# EAGLE design supply (EAGLE 4.11)
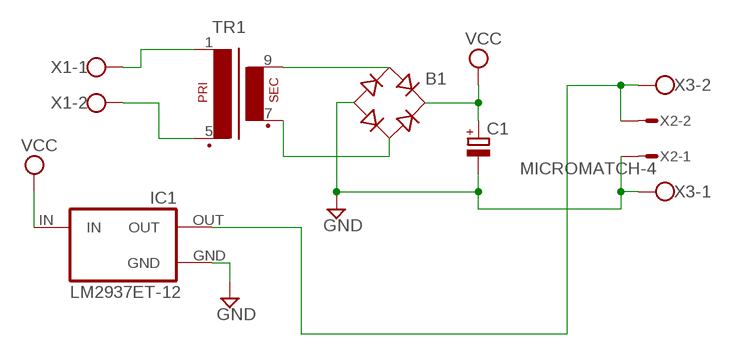
[diagram p0: schematic, sheet 1]

## Parts
B1  RB1A  [RB1A]
C1  CPOL-EUE5-10.5  [E5-10,5]
IC1  LM2937ET-12  [TO220(V)]
TR1  EI30-1  [EI30-1]
X1  W237-102  [W237-102]
X2  MICROMATCH-4  [MICROMATCH-4]
X3  W237-102  [W237-102]

## Nets
GND: B1.- C1.- IC1.GND X2.1 X3.1
N$1: TR1.1 X1.1
N$2: TR1.5 X1.2
N$3: B1.AC1 TR1.9
N$4: B1.AC2 TR1.7
N$7: IC1.OUT X2.2 X3.2
VCC: B1.+ C1.+ IC1.IN
Unconnected: X2.3 X2.4

## Library data of the parts
B1 = rectifier:RB1A: RECTIFIER 1 A
C1 = rcl:CPOL-EU: POLARIZED CAPACITOR, European symbol
IC1 = lm2937:LM2937ET*: 400 and 500 mA Low Dropout Voltage Regulator NATIONAL SEMICONDUCTOR created by Peter.Hofmann@ph-tronic.de <mailto:Reter.Hofmann@ph-tronic.de> 10-2004 Rev.0
TR1 = trafo:EI30-1: TRANSFORMER 1 primary winding, 1 secondary winding ERA
X1 X3 = con-wago-500:W237-102: WAGO SCREW CLAMP
X2 = con-amp-micromatch:MICROMATCH-4: MicroMaTch 4 7-215464-4 / 0-215464-4 Drawing Number C-215464 DDEController.pdf

## Board
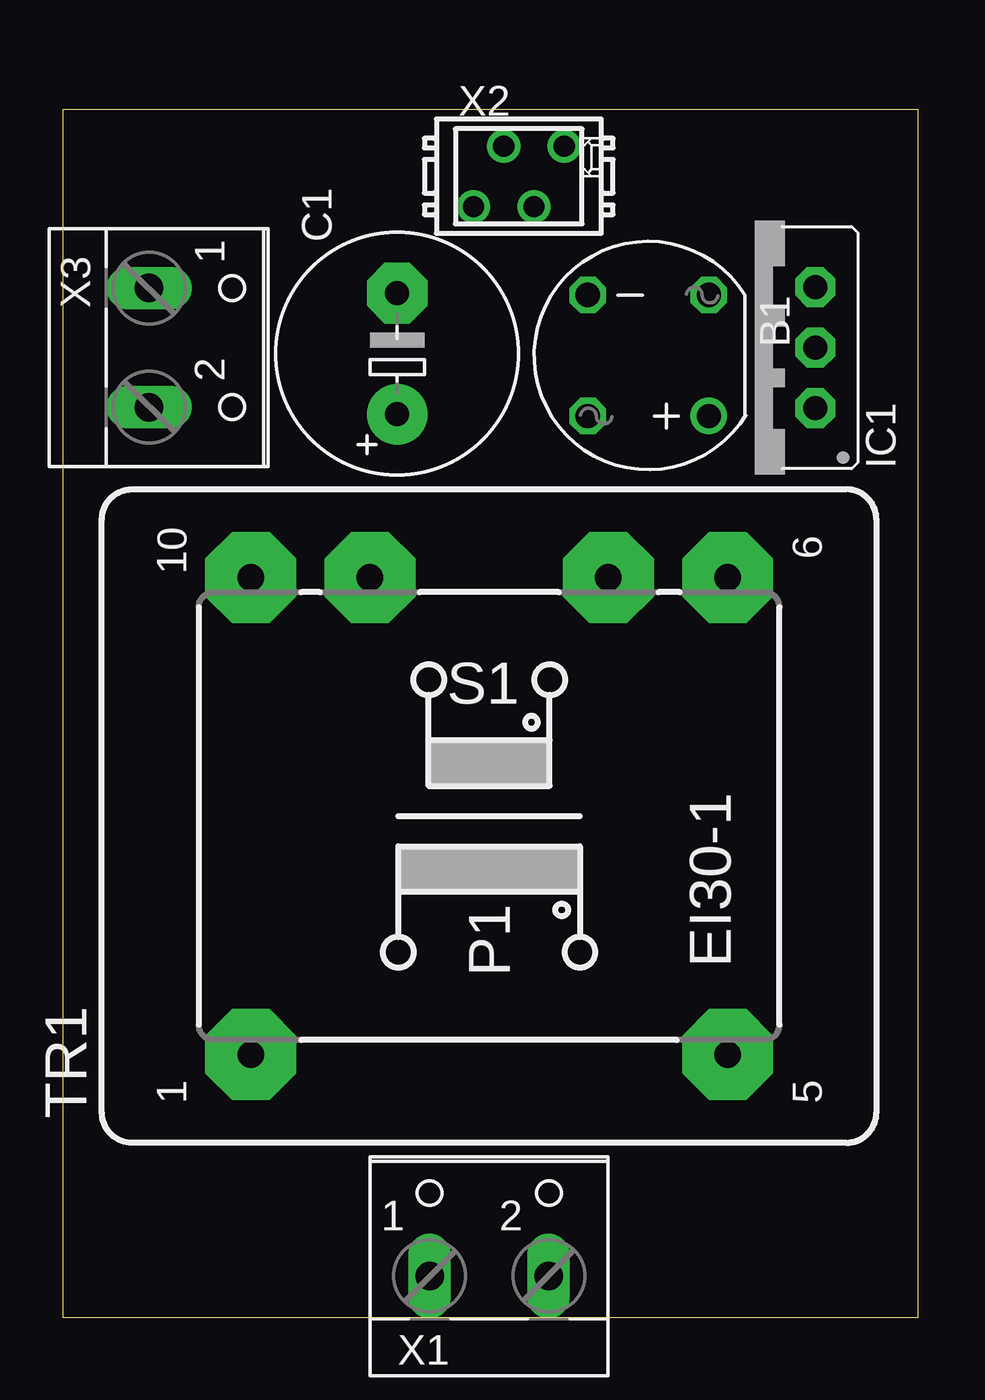
[diagram p1: board, top side]
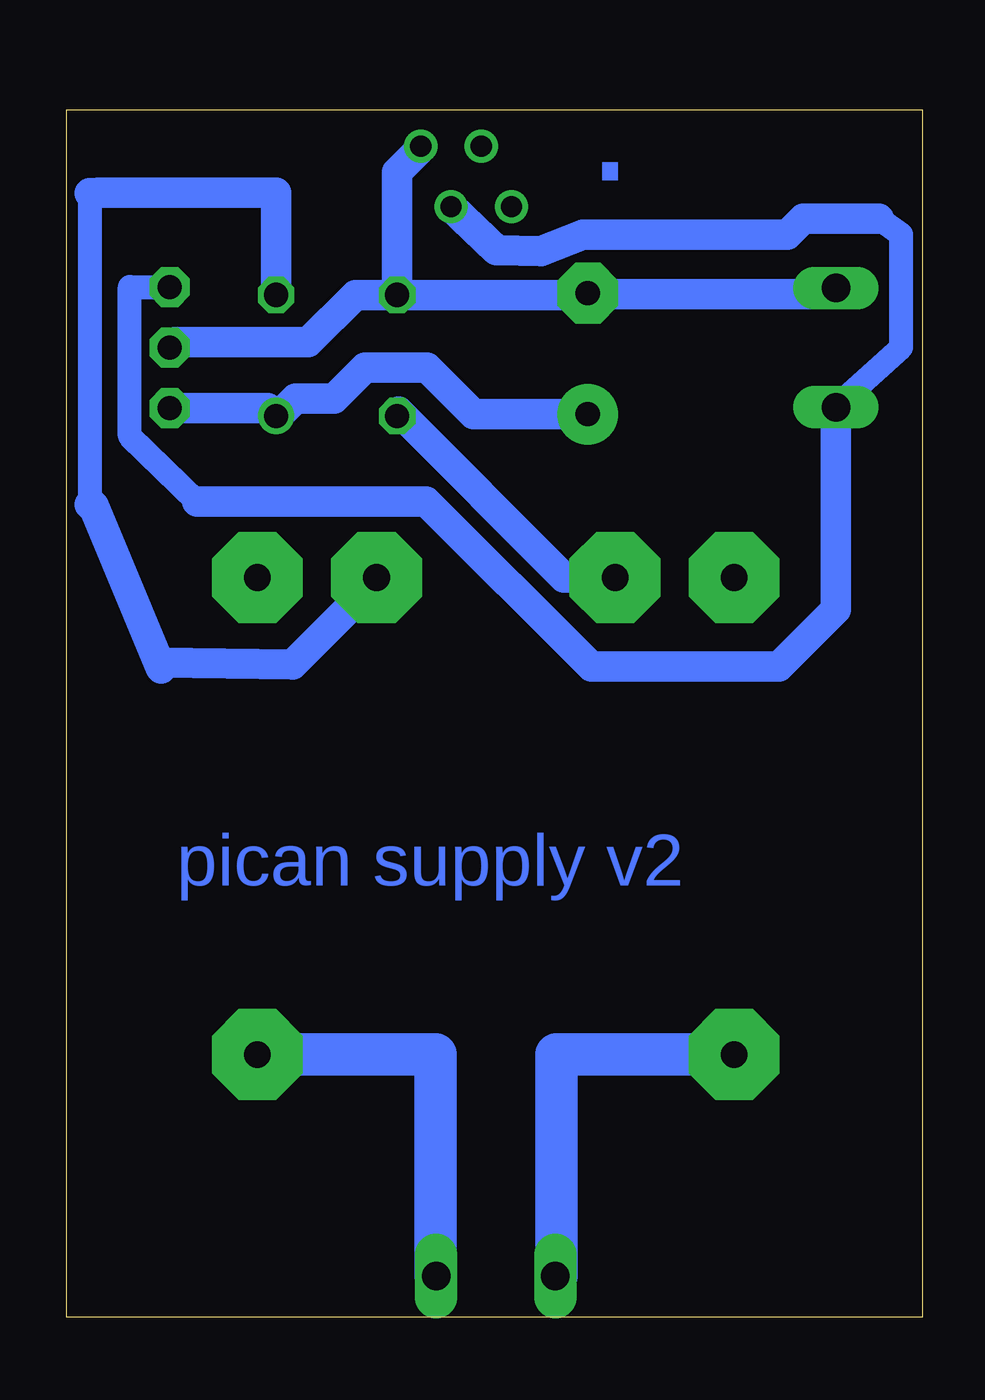
[diagram p2: board, bottom side, seen from below]

Size 35.92 x 50.7 mm. Coordinates in mm from the lower left corner, seen from the top.
Outline: 0,0 35.92,0 35.92,50.7 0,50.7 0,0
Copper layers (1*16): Top 0.035mm / dielectric 1.5mm / Bottom 0.035mm
Design rules "default": minimum track width 10mil, minimum drill 24mil, track to track 8mil, track to pad 8mil, pad to pad 8mil, via to via 8mil, smd to smd 8mil, copper to edge 40mil, drill to drill 8mil, minimum pad ring 10mil, minimum via ring 8mil, stop-mask expansion 4mil, vias tented up to drill 0mil, thermal gap 10mil

### Footprints (pad centres in the part's own frame; a part is rotated, then mirrored left to right if it is on the bottom)
RB1A = drill 1.016 round: + -2.54,2.54 | drill 1.016 octagon: - 2.54,-2.54; AC1 2.54,2.54; AC2 -2.54,-2.54
E5-10,5 = drill 1.016 pad 2.54 round: + -2.54,0 | drill 1.016 pad 2.54 octagon: - 2.54,0
TO220(V) = drill 1.016 pad 1.676 octagon: GND 0,0; IN -2.54,0; OUT 2.54,0
EI30-1 = drill 1.118 pad 3.81 octagon: 1 -10.008,10.008; 5 -10.008,-10.008; 6 10.008,-10.008; 7 10.008,-5.004; 9 10.008,5.004; 10 10.008,10.008
W237-102 = drill 1.194 long: 1 -2.5,-1.27; 2 2.5,-1.27
MICROMATCH-4 = drill 0.889 round: 1 1.905,1.27; 2 0.635,-1.27; 3 -0.635,1.27; 4 -1.905,-1.27

### Placement (x,y rotation side)
B1  24.58,40.37 180 top
C1  14.04,40.45 90 top
IC1  31.59,40.7 90 top
TR1  17.9,21.04 90 top
X1  17.9,3.01 0 top
X2  19.15,47.89 0 top
X3  4.9,40.7 270 top

### Tracks (layer width: path | path; a pad name or v marks a point on that pad's centre or on a via)
GND
  Bottom 1.27: X2.1 21.05,49.06 22.04,48.07 B1.- | B1.- 23.79,42.91 25.78,40.93 31.39,40.93 31.62,40.7 | 31.62,40.7 31.67,40.65 | 31.62,40.7 IC1.GND | 13.94,42.94 13.99,42.99 C1.- | B1.- 13.96,42.91 13.94,42.94 | X3.1 3.49,43.2 3.45,43.17 3.68,42.94 13.94,42.94
N$1
  Bottom 1.778: X1.1 15.36,1.74 15.36,11.04 TR1.1
N$2
  Bottom 1.778: X1.2 20.44,1.74 20.44,11.04 TR1.5
N$3
  Bottom 1.27: B1.AC1 22.04,37.96 21.99,38.01 15.03,31.05 TR1.9
N$4
  Bottom 1.016: 34.95,47.18 34.95,34.12
  Bottom 1.27: B1.AC2 27.12,47.21 34.59,47.21 34.95,47.18 | 34.95,34.12 34.79,34.1 31.95,27.24 32.02,27.5 26.44,27.39 22.83,31 22.88,31.05 TR1.7
N$7
  Bottom 1.016: IC1.OUT 33.27,43.24 33.27,36.99 30.45,34.25 | 1.82,46.11 0.88,45.45 0.88,40.7 3.65,38.21
  Bottom 1.27: 30.45,34.25 20.82,34.25 13.89,27.32 6.02,27.32 3.63,29.7 X3.2 | X3.2 3.63,38.21 3.65,38.24 | X2.2 17.88,44.79 16,44.74 14.24,45.45 5.66,45.45 5,46.11 1.82,46.11 | 3.65,38.21 X3.2
VCC
  Bottom 1.27: 27.12,37.81 27.1,37.78 | 27.12,37.81 B1.+ 27.1,37.83 27.07,37.81 26.31,38.57 24.68,38.57 23.39,39.87 20.8,39.87 18.84,37.91 C1.+ | IC1.IN 27.48,38.16 27.12,37.81

### Text on the board
Bottom: . | pican supply v2